# EAGLE schematic MainBoard v1.4 (EAGLE 7.1.0)
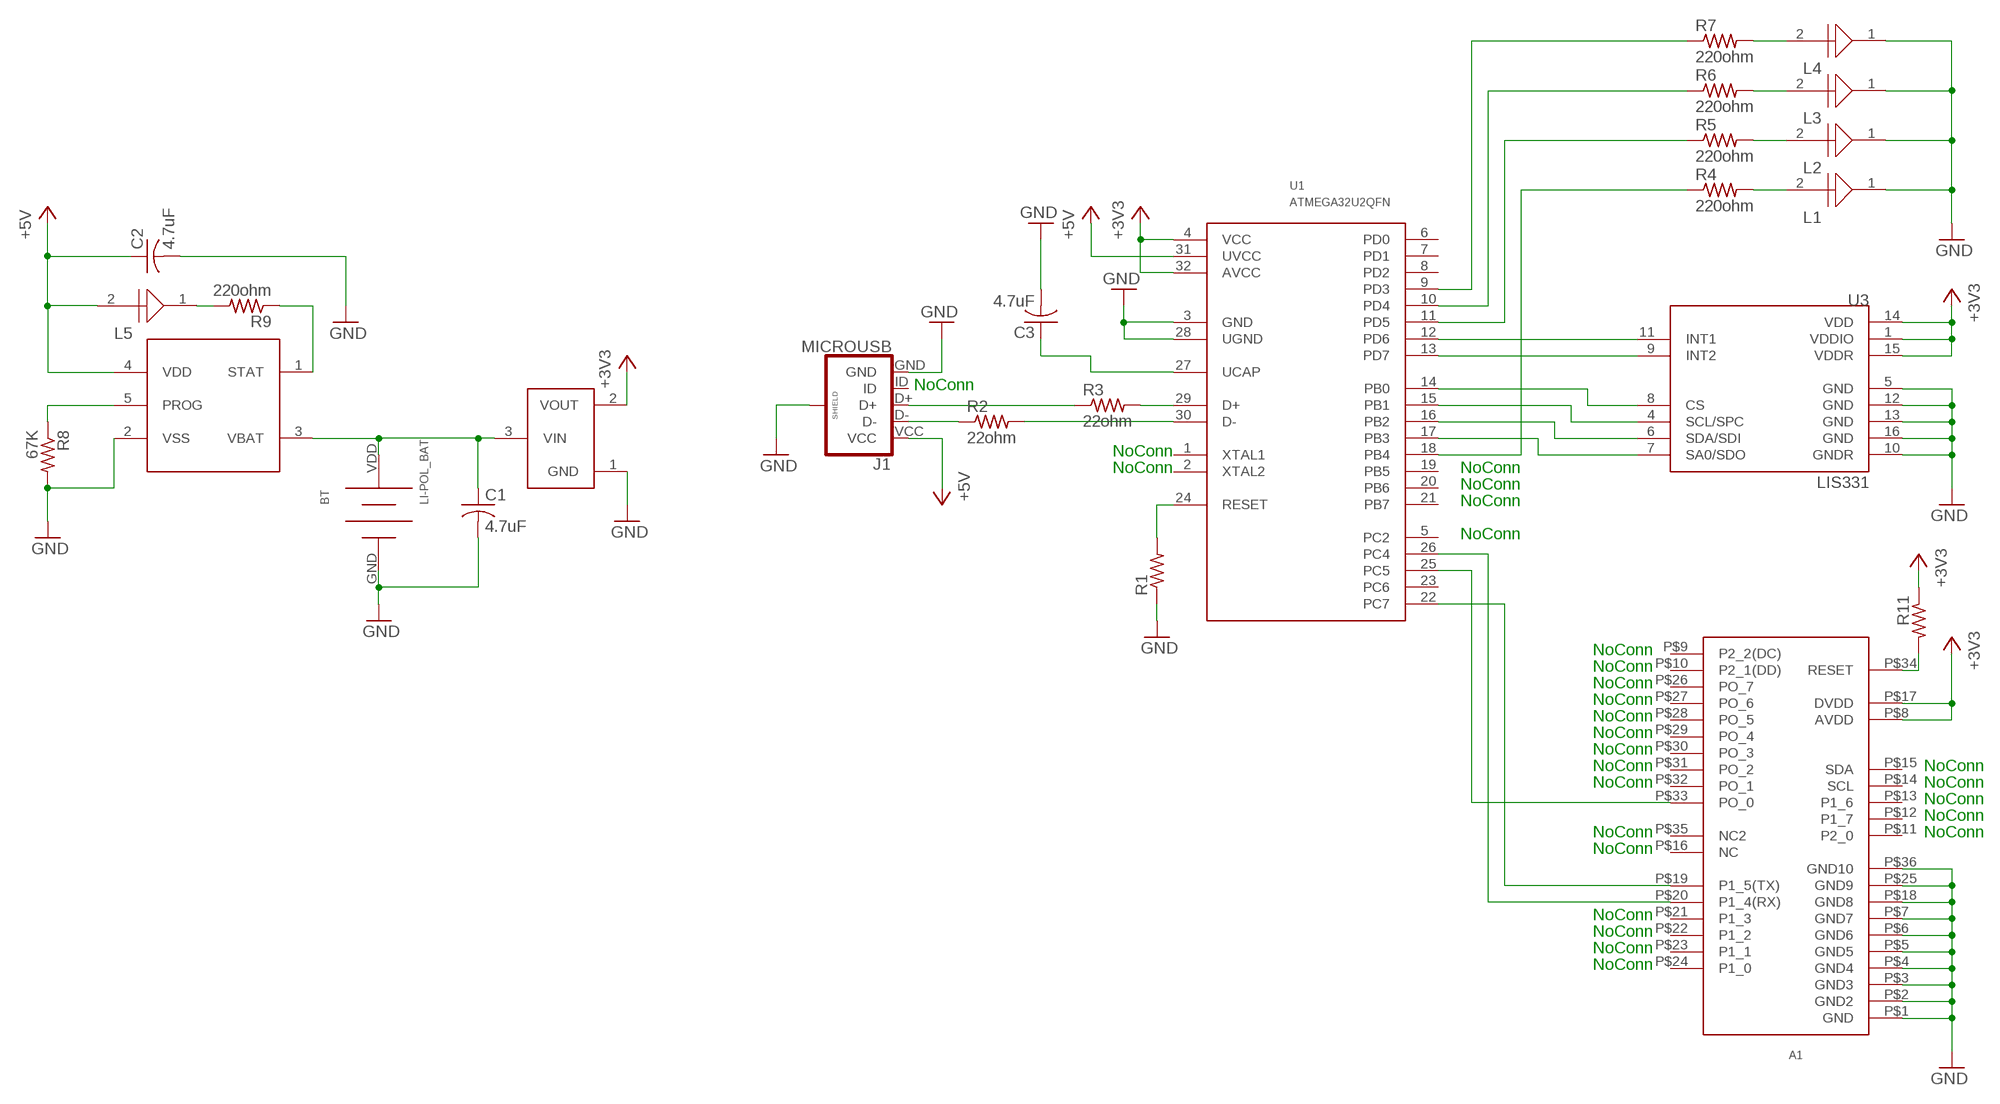
[diagram p0: schematic, sheet 1]

## Parts
A1  BLE113-A  [BLUETOOTHNS]
BT  LI-POL_BAT  [LI-POLY_28]
C1  4.7uF  C-USC0402  [C0402]
C2  4.7uF  C-USC0402  [C0402]
C3  4.7uF  C-USC0402  [C0402]
J1  MICROUSB  [MICROUSB]
L1  LED_0402  [R0402]
L2  LED_0402  [R0402]
L3  LED_0402  [R0402]
L4  LED_0402  [R0402]
L5  LED_0402  [R0402]
R1  R-US_R0402  [R0402]
R2  22ohm  R-US_R0402  [R0402]
R3  22ohm  R-US_R0402  [R0402]
R4  220ohm  R-US_R0402  [R0402]
R5  220ohm  R-US_R0402  [R0402]
R6  220ohm  R-US_R0402  [R0402]
R7  220ohm  R-US_R0402  [R0402]
R8  67K  R-US_R0402  [R0402]
R9  220ohm  R-US_R0402  [R0402]
R11  R-US_R0402  [R0402]
U1  ATMEGA32U2QFN  [QFN-32]
U2  MCP738312  [SOT23-5]
U3  LIS331  [LGA16-3MM]
U5  REGULATOR  [SOT23-3]

## Nets
+3V3: A1.P$8(AVDD) A1.P$17(DVDD) R11.1 U1.4(VCC) U1.32(AVCC) U3.1(VDDIO) U3.14(VDD) U3.15(VDDR) U5.2(VOUT)
+5V: C2.1 J1.VCC L5.2 U1.31(UVCC) U2.4(VDD)
GND: A1.P$1(GND) A1.P$2(GND2) A1.P$3(GND3) A1.P$4(GND4) A1.P$5(GND5) A1.P$6(GND6) A1.P$7(GND7) A1.P$18(GND8) A1.P$25(GND9) A1.P$36(GND10) BT.GND C1.2 C2.2 C3.2 J1.GD1(SHIELD) J1.GD2(SHIELD) J1.GD3(SHIELD) J1.GD4(SHIELD) J1.GND L1.1 L2.1 L3.1 L4.1 R1.1 R8.2 U1.3(GND) U1.28(UGND) U2.2(VSS) U3.5(GND) U3.10(GNDR) U3.12(GND) U3.13(GND) U3.16(GND) U5.1(GND)
N$1: R3.2 U1.29(D+)
N$2: R2.2 U1.30(D-)
N$3: R1.2 U1.24(RESET)
N$4: L1.2 R4.2
N$5: L2.2 R5.2
N$6: L3.2 R6.2
N$7: L4.2 R7.2
N$8: J1.D+ R3.1
N$9: J1.D- R2.1
N$10: BT.VDD C1.1 U2.3(VBAT) U5.3(VIN)
N$11: A1.P$34(RESET) R11.2
N$12: R8.1 U2.5(PROG)
N$13: R9.1 U2.1(STAT)
N$14: L5.1 R9.2
N$15: U1.12(PD6) U3.11(INT1)
N$16: R4.1 U1.18(PB4)
N$17: R6.1 U1.10(PD4)
N$18: U1.15(PB1) U3.4(SCL/SPC)
N$19: U1.14(PB0) U3.8(CS)
N$20: R5.1 U1.11(PD5)
N$21: U1.16(PB2) U3.6(SDA/SDI)
N$22: U1.17(PB3) U3.7(SA0/SDO)
N$23: U1.13(PD7) U3.9(INT2)
N$25: A1.P$20(P1_4(RX)) U1.26(PC4)
N$26: A1.P$19(P1_5(TX)) U1.22(PC7)
N$27: A1.P$33(PO_0) U1.25(PC5)
N$31: R7.1 U1.9(PD3)
N$33: C3.1 U1.27(UCAP)
Unconnected: A1.P$9(P2_2(DC)) A1.P$10(P2_1(DD)) A1.P$11(P2_0) A1.P$12(P1_7) A1.P$13(P1_6) A1.P$14(SCL) A1.P$15(SDA) A1.P$16(NC) A1.P$21(P1_3) A1.P$22(P1_2) A1.P$23(P1_1) A1.P$24(P1_0) A1.P$26(PO_7) A1.P$27(PO_6) A1.P$28(PO_5) A1.P$29(PO_4) A1.P$30(PO_3) A1.P$31(PO_2) A1.P$32(PO_1) A1.P$35(NC2) J1.ID U1.1(XTAL1) U1.2(XTAL2) U1.5(PC2) U1.6(PD0) U1.7(PD1) U1.8(PD2) U1.19(PB5) U1.20(PB6) U1.21(PB7) U1.23(PC6)

## Notes on the sheet
- NoConn
- NoConn
- NoConn | NoConn
- NoConn
- NoConn
- NoConn
- NoConn
- NoConn
- NoConn
- NoConn
- NoConn
- NoConn
- NoConn
- NoConn | NoConn
- NoConn | NoConn
- NoConn
- NoConn
- NoConn | NoConn
- NoConn
- NoConn
- NoConn
- NoConn
- NoConn

## Library data of the parts
A1 = BitFit:BLE113-A
BT = BitFit:LI-POL_BAT
C1-C3 = BitFit:C-US: CAPACITOR, American symbol
J1 = BitFit:MICROUSB
L1-L5 = BitFit:LED_0402
R1-R9 R11 = BitFit:R-US_: RESISTOR, American symbol
U1 = BitFit:ATMEGA32U2
U2 = BitFit:MCP738312
U3 = SparkFun-Sensors:LIS331: 3-axis 6/12/24g SPI/I2C accelerometer
U5 = BitFit:REGULATOR